# EAGLE schematic NAND (EAGLE 7.4.0)
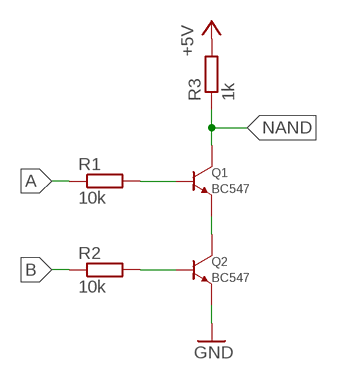
[diagram p0: schematic, sheet 1]

## Parts
Q1  BC547  TRANSISTOR-NPN-GENERICDEFAULT-SOT23-BEC  [SOT23]
Q2  BC547  TRANSISTOR-NPN-GENERICDEFAULT-SOT23-BEC  [SOT23]
R1  10k  R-EU_R0603  [R0603]
R2  10k  R-EU_R0603  [R0603]
R3  1k  R-EU_R0603  [R0603]

## Nets
+5V: R3.2
A: R1.1
B: R2.1
GND: Q2.P$2(EMITTER)
N$1: Q1.P$2(EMITTER) Q2.P$3(COLLECTOR)
N$3: Q2.P$1(BASE) R2.2
N$4: Q1.P$1(BASE) R1.2
NAND: Q1.P$3(COLLECTOR) R3.1

## Library data of the parts
Q1 Q2 = p.peter-scoville.tests:TRANSISTOR-NPN-GENERIC; SV_SPICE_ORDER: COLLECTOR;BASE;EMITTER; SV_SPICE_PREFIX: Q
R1-R3 = p.peter-scoville.tests:R-EU_: RESISTOR, European symbol; SV_SPICE_ORDER: 1;2; SV_SPICE_PREFIX: R